# Altium schematic sheet TL201蓝牙LED显示.SchDoc
size A4
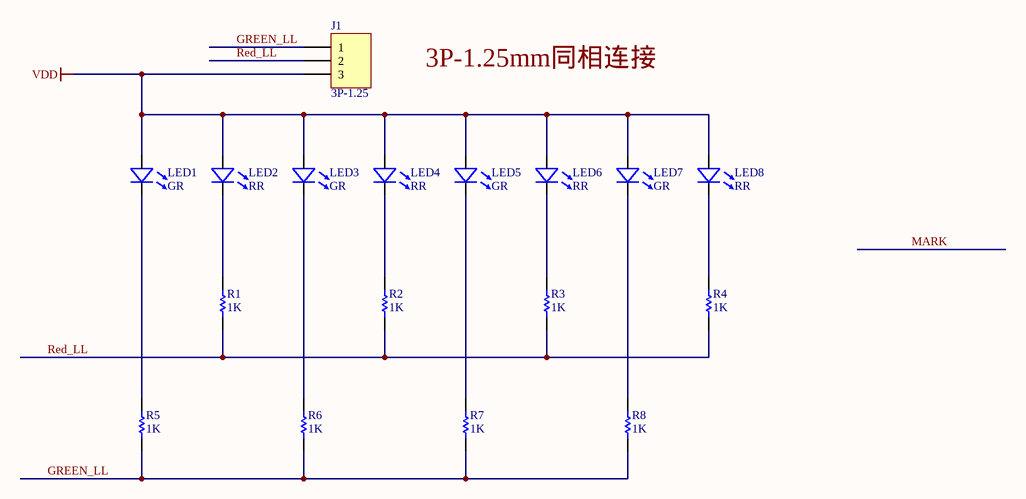
[diagram p0: TL201蓝牙LED显示.SchDoc]

## Parts
J1  3P-1.25  [3P-1.25]
LED1  GR  [0603LED]
LED2  RR  [0603LED]
LED3  GR  [0603LED]
LED4  RR  [0603LED]
LED5  GR  [0603LED]
LED6  RR  [0603LED]
LED7  GR  [0603LED]
LED8  RR  [0603LED]
R1  1K  [R0603]
R2  1K  [R0603]
R3  1K  [R0603]
R4  1K  [R0603]
R5  1K  [R0603]
R6  1K  [R0603]
R7  1K  [R0603]
R8  1K  [R0603]

## Nets
VDD: J1.3 LED1.1(a) LED2.1(a) LED3.1(a) LED4.1(a) LED5.1(a) LED6.1(a) LED7.1(a) LED8.1(a)
GREEN_LL: J1.1 R5.2 R6.2 R7.2 R8.2
Red_LL: J1.2 R1.2 R2.2 R3.2 R4.2
NetLED1_2: LED1.2(k) R5.1
NetLED2_2: LED2.2(k) R1.1
NetLED3_2: LED3.2(k) R6.1
NetLED4_2: LED4.2(k) R2.1
NetLED5_2: LED5.2(k) R7.1
NetLED6_2: LED6.2(k) R3.1
NetLED7_2: LED7.2(k) R8.1
NetLED8_2: LED8.2(k) R4.1

## Notes on the sheet
- 3P-1.25mm同相连接

## Library data of the parts
J1 = Header 3: Header, 3-Pin; LatestRevisionDate: 17-Jul-2002; LatestRevisionNote: Re-released for DXP Platform.; Publisher: Altium Limited
LED1-LED8 = LED
R1-R8 = Res1: Resistor; Published: 8-Jun-2000; LatestRevisionDate: 17-Jul-2002; LatestRevisionNote: Re-released for DXP Platform.; PackageReference: AXIAL-0.3; Publisher: Altium Limited; PackageDescription: Axial Device, Thru-Hole; 2 Leads; 0.3 in Pin Spacing; Value: 1K